# EAGLE design MiniMoto (EAGLE 6.4)
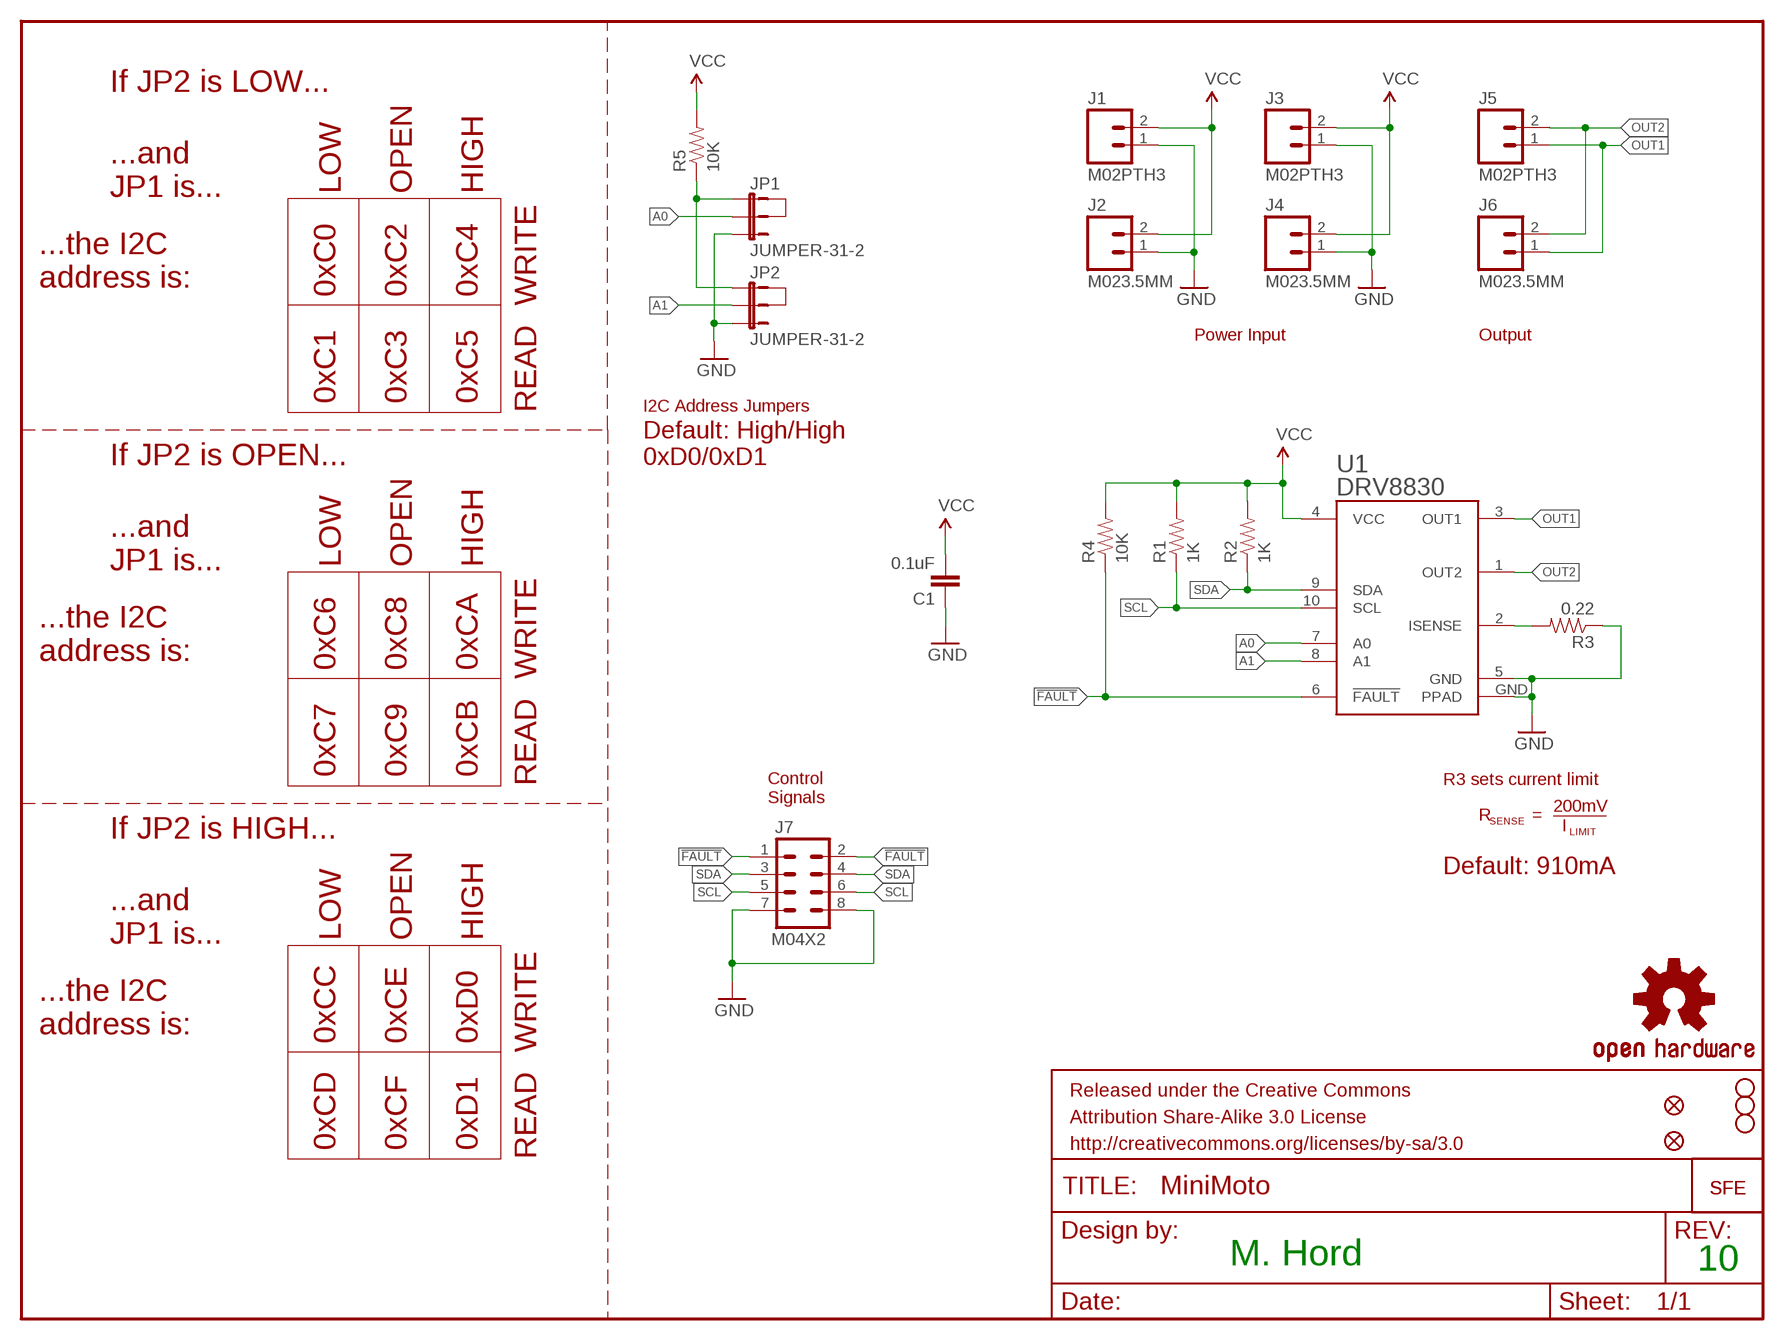
[diagram p0: schematic, sheet 1]

## Parts
C1  0.1uF  0.1UF-25V(+80/-20%)(0603)  [0603-CAP]
FID1  FIDUCIALUFIDUCIAL  [MICRO-FIDUCIAL]
FID2  FIDUCIALUFIDUCIAL  [MICRO-FIDUCIAL]
FRAME1  FRAME-LETTER  [CREATIVE_COMMONS]
J1  M02PTH3  [1X02_LONGPADS]
J2  M023.5MM  [SCREWTERMINAL-3.5MM-2]
J3  M02PTH3  [1X02_LONGPADS]
J4  M023.5MM  [SCREWTERMINAL-3.5MM-2]
J5  M02PTH3  [1X02_LONGPADS]
J6  M023.5MM  [SCREWTERMINAL-3.5MM-2]
J7  M04X2  [2X4]
JP1  JUMPER-31-2  [SJ_3_PASTE1&2]
JP2  JUMPER-31-2  [SJ_3_PASTE1&2]
LOGO1  LOGO-SFESK  [SFE-LOGO-FLAME]
LOGO2  OSHW-LOGOS  [OSHW-LOGO-S]
LOGO3  LOGO-SFESK  [SFE-LOGO-FLAME]
R1  1K  1KOHM1/10W1%(0603)  [0603-RES]
R2  1K  1KOHM1/10W1%(0603)  [0603-RES]
R3  0.22  0.22OHM1/4W1%(0805)  [0805]
R4  10K  10KOHM1/10W1%(0603)0603  [0603-RES]
R5  10K  10KOHM1/10W1%(0603)0603  [0603-RES]
STANDOFF1  STAND-OFF  [STAND-OFF]
STANDOFF2  STAND-OFF  [STAND-OFF]
STANDOFF3  STAND-OFF  [STAND-OFF]
U1  DRV8830  [MSOP-10-GNDPAD]

## Nets
!FAULT: J7.1 J7.2 R4.1 U1.6(!FAULT)
A0: JP1.2 U1.7(A0)
A1: JP2.2 U1.8(A1)
GND: C1.1 J1.1 J2.1 J3.1 J4.1 J7.7 J7.8 JP1.3 JP2.3 R3.1 U1.5(GND) U1.GND(PPAD)
N$1: JP1.1 JP2.1 R5.1
N$3: R3.2 U1.2(ISENSE)
OUT1: J5.1 J6.1 U1.3(OUT1)
OUT2: J5.2 J6.2 U1.1(OUT2)
SCL: J7.5 J7.6 R1.1 U1.10(SCL)
SDA: J7.3 J7.4 R2.1 U1.9(SDA)
VCC: C1.2 J1.2 J2.2 J3.2 J4.2 R1.2 R2.2 R4.2 R5.2 U1.4(VCC)

## Notes on the sheet
- If JP2 is LOW...
- LOW | OPEN | HIGH
- ...and
  JP1 is...
- ...the I2C
  address is:
- 0xC0 | 0xC2 | 0xC4
- WRITE
- Power Input | Output
- 0xC1 | 0xC3 | 0xC5
- READ | I2C Address Jumpers
- If JP2 is OPEN...
- Default: High/High
  0xD0/0xD1
- LOW | OPEN | HIGH
- ...and
  JP1 is...
- ...the I2C
  address is:
- 0xC6 | 0xC8 | 0xCA | WRITE
- 0xC7 | 0xC9 | 0xCB | READ
- R3 sets current limit
- Control
  Signals
- 200mV
- R | =
- SENSE
- I
- LIMIT
- If JP2 is HIGH...
- Default: 910mA
- LOW | OPEN | HIGH
- ...and
  JP1 is...
- ...the I2C
  address is:
- 0xCC | 0xCE | 0xD0 | WRITE
- 0xCD | 0xCF | 0xD1 | READ
- M. Hord | 10

## Library data of the parts
C1 = SparkFun-Capacitors:0.1UF-25V(+80/-20%)(0603): Ceramic Standard decoupling cap CAP-00810; PROD_ID: CAP-00810
FID1 FID2 = SparkFun-Aesthetics:FIDUCIAL: Fiducial Alignment Points Various fiducial points for machine vision alignment.
FRAME1 = SparkFun-Aesthetics:FRAME-LETTER: Schematic Frame Standard 8.5x11 US Letter frame
J1-J6 = SparkFun-Connectors:M02: Standard 2-pin 0.1" header. Use with - straight break away headers ( PRT-00116) - right angle break away headers (PRT-00553) - swiss pins (PRT-00743) - machine pins (PRT-00117) - female headers (PRT-00115) Molex polarized connector foot print use with: PRT-08233 with associated crimp pins and housings. 2.54_SCREWTERM for use with PRT-10571. 3.5mm Screw Terminal footprints for PRT-08084 5mm Screw Terminal footprints for use with PRT-08433
J7 = SparkFun-Connectors:M04X2: .1" header, two rows of four.
JP1 JP2 = SparkFun-Passives:JUMPER-3
LOGO1 LOGO3 = SparkFun-Aesthetics:LOGO-SFE: Spark Fun Electronics PCB Logo This is the standard Spark Fun Electronics PCB logo.
LOGO2 = SparkFun-Aesthetics:OSHW-LOGO: Open Source Hardware Logo This logo indicates the piece of hardware it is found on incorporates a OSHW license and/or adheres to the definition of open source hardware found here: http://freedomdefined.org/OSHW
R1 R2 = SparkFun-Resistors:1KOHM1/10W1%(0603): RES-07856; PROD_ID: RES-07856
R3 = SparkFun-Resistors:0.22OHM1/4W1%(0805): RES-09883; PROD_ID: RES-09883
R4 R5 = SparkFun-Resistors:10KOHM1/10W1%(0603): RES-00824; PROD_ID: RES-00824
STANDOFF1-STANDOFF3 = SparkFun-Electromechanical:STAND-OFF: #4 Stand Off This is the mechanical footprint for a #4 phillips button head screw. Use the keepout ring to avoid running the screw head into surrounding components. SKU : PRT-00447
U1 = SparkFun-PowerIC:DRV8830: DRV8830 I2C DC Motor Driver TSSOP-10 with exposed power pad 1A current limit, 2.75V to 6.8V

## Board
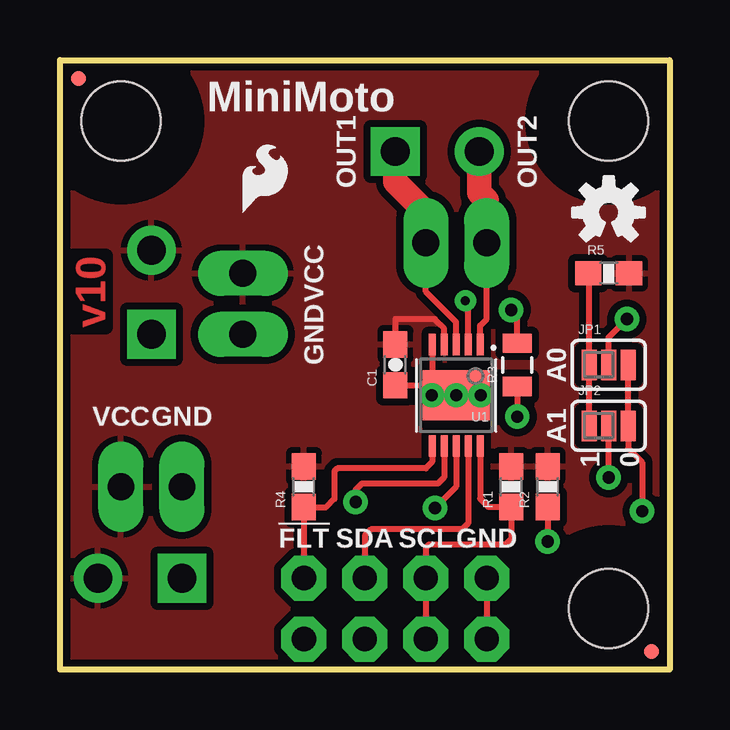
[diagram p1: board, top side]
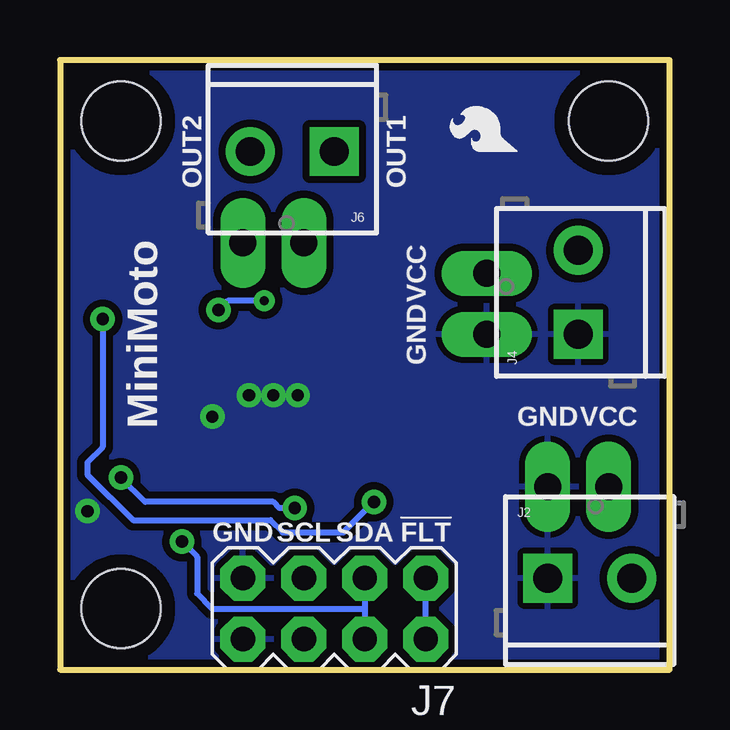
[diagram p2: board, bottom side, seen from below]

Size 25.4 x 25.4 mm. Coordinates in mm from the lower left corner, seen from the top.
Outline: 0,0 0,25.4 25.4,25.4 25.4,0 0,0
Copper layers (1*16): Top 0.035mm / dielectric 1.5mm / Bottom 0.035mm
Design rules "Sparkfun": minimum track width 8mil, minimum drill 20mil, track to track 8mil, track to pad 8mil, pad to pad 8mil, via to via 8mil, smd to smd 8mil, copper to edge 8mil, drill to drill 8mil, minimum pad ring 12mil, minimum via ring 10mil, stop-mask expansion 4mil, vias tented up to drill 20mil, thermal gap 10mil
tRestrict: area -0.5,19.8 to 5.6,25.9; area 19.8,19.8 to 25.9,25.9; area 19.8,-0.5 to 25.9,5.6

### Footprints (pad centres in the part's own frame; a part is rotated, then mirrored left to right if it is on the bottom)
0603-CAP = smd 1.1 x 1: 1 -0.85,0; 2 0.85,0
MICRO-FIDUCIAL = smd 0.635 x 0.635: 1 0,0
1X02_LONGPADS = drill 1.118 pad 1.88 long: 1 0,0; 2 2.54,0
SCREWTERMINAL-3.5MM-2 = drill 1.2 pad 2.032 square: 1 0,0 | drill 1.2 pad 2.032: 2 3.5,0
2X4 = drill 1.016 pad 1.88 octagon: 1 -3.81,-1.27; 2 -3.81,1.27; 3 -1.27,-1.27; 4 -1.27,1.27; 5 1.27,-1.27; 6 1.27,1.27; 7 3.81,-1.27; 8 3.81,1.27
SJ_3_PASTE1&2 = smd 0.635 x 1.27: 1 -0.813,0; 2 0,0; 3 0.813,0
0603-RES = smd 1.1 x 1: 1 -0.85,0; 2 0.85,0
0805 = smd 0.8 x 1.2: 1 -0.9,0; 2 0.9,0
STAND-OFF = hole 3.302: 0,0
MSOP-10-GNDPAD = smd 0.305 x 0.889: 1 -1,-2.11; 2 -0.5,-2.11; 3 0,-2.11; 4 0.5,-2.11; 5 1,-2.11; 6 1,2.11; 7 0.5,2.11; 8 0,2.11; 9 -0.5,2.11; 10 -1,2.11 | smd 2.794 x 2.083: GND 0,0

### Placement (x,y rotation side)
C1  13.97,12.7 90 top
FID1  0.76,24.64 0 top
FID2  24.64,0.76 0 top
FRAME1  -77.47,11.43 0 top  (outside the outline)
J1  5.08,7.62 0 bottom
J2  5.08,3.81 0 bottom
J3  7.62,13.97 90 top
J4  3.81,13.97 90 bottom
J5  15.24,17.78 180 bottom
J6  13.97,21.59 180 bottom
J7  13.97,2.54 180 bottom
JP1  22.86,12.7 0 top
JP2  22.86,10.16 0 top
LOGO1  7.62,19.05 0 top
LOGO2  22.86,19.05 0 top
LOGO3  6.35,21.59 90 bottom
R1  18.8,7.62 90 top
R2  20.32,7.62 90 top
R3  19.05,12.7 90 top
R4  10.16,7.62 90 top
R5  22.86,16.51 0 top
STANDOFF1  2.54,22.86 0 top
STANDOFF2  22.86,22.86 0 top
STANDOFF3  22.86,2.54 0 top
U1  16.51,11.43 180 top

### Tracks (layer width: path | path; a pad name or v marks a point on that pad's centre or on a via)
!FAULT
  Top 0.254: U1.6 15.51,8.65 15.24,8.38 11.56,8.38 11.43,8.26 11.43,7.11 11.09,6.77 R4.1 J7.1
  Bottom 0.254: J7.2 J7.1
A0  (via drill 0.51)
  Top 0.254: U1.7 16.01,8.01 15.75,7.75 12.57,7.75 12.32,7.49 v12.32,6.99 | JP1.2 22.86,13.84 v23.62,14.61
  Bottom 0.254: v23.62,14.61 23.62,9.27 24.26,8.64 24.26,8.13 22.35,6.22 16.64,6.22 16.13,5.71 13.59,5.71 v12.32,6.99
A1  (via drill 0.51)
  Top 0.254: U1.8 16.51,7.62 v15.62,6.73 | v22.86,8 JP2.2
  Bottom 0.254: v15.62,6.73 16.26,6.73 16.51,6.99 21.84,6.99 v22.86,8
GND  (via drill 0.51)
  Top 0.254: C1.1 15.07,11.85 | 15.07,11.85 v15.49,11.43 | U1.5 15.51,12.29 15.07,11.85 | R3.1 v19.05,10.54 | v24.26,6.6 24.26,8.64 23.67,9.22 JP2.3 JP1.3 | J7.7 J7.8
  other vias: 16.51,11.43 17.53,11.43
  pour Bottom (isolate 0.305): 0,25.4 25.4,25.4 25.4,0 0,0
N$1
  Top 0.254: JP2.1 JP1.1 22.05,16.47 R5.1
N$3  (via drill 0.38, 0.51)
  Top 0.254: U1.2 17.01,15.23 v16.89,15.37 | R3.2 19.05,14.73 v18.8,14.99
  Bottom 0.254: v16.89,15.37 18.41,15.37 v18.8,14.99
OUT1
  Top 0.254: U1.3 16.51,14.48 15.24,15.75 J5.1
  Top 1.016: J5.1 15.24,19.05 13.97,20.32 J6.1
OUT2
  Top 0.254: U1.1 17.51,14.34 17.78,14.61 J5.2
  Top 1.016: J5.2 17.78,19.56 17.47,19.87 J6.2
SCL
  Top 0.254: U1.10 17.51,7.13 17.87,6.77 R1.1 18.8,5.46 18.54,5.21 15.37,5.21 15.24,5.08 J7.5 J7.6
SDA  (via drill 0.51)
  Top 0.254: R2.1 v20.32,5.33 | U1.9 17.01,6.09 16.76,5.84 12.95,5.84 12.7,5.59 J7.3
  Bottom 0.254: v20.32,5.33 19.68,4.7 19.68,3.17 19.05,2.54 12.7,2.54 | J7.3 12.7,2.54 | 12.7,2.54 J7.4
VCC
  Top 0.254: U1.4 16.01,14.22 15.62,14.61 13.97,14.61 C1.2
  pour Top (isolate 0.305): 0,25.4 25.4,25.4 25.4,0 0,0

### Text on the board
Top: v10
tPlace: MiniMoto | OUT1 | OUT2 | VCC | GND | A0 | VCC | GND | A1 | 1 | 0 | !FLT | SDA | SCL | GND
bPlace: OUT1 | OUT2 | VCC | GND | MiniMoto | VCC | GND | !FLT | SDA | SCL | GND